# Altium schematic sheet power.SchDoc
size A4
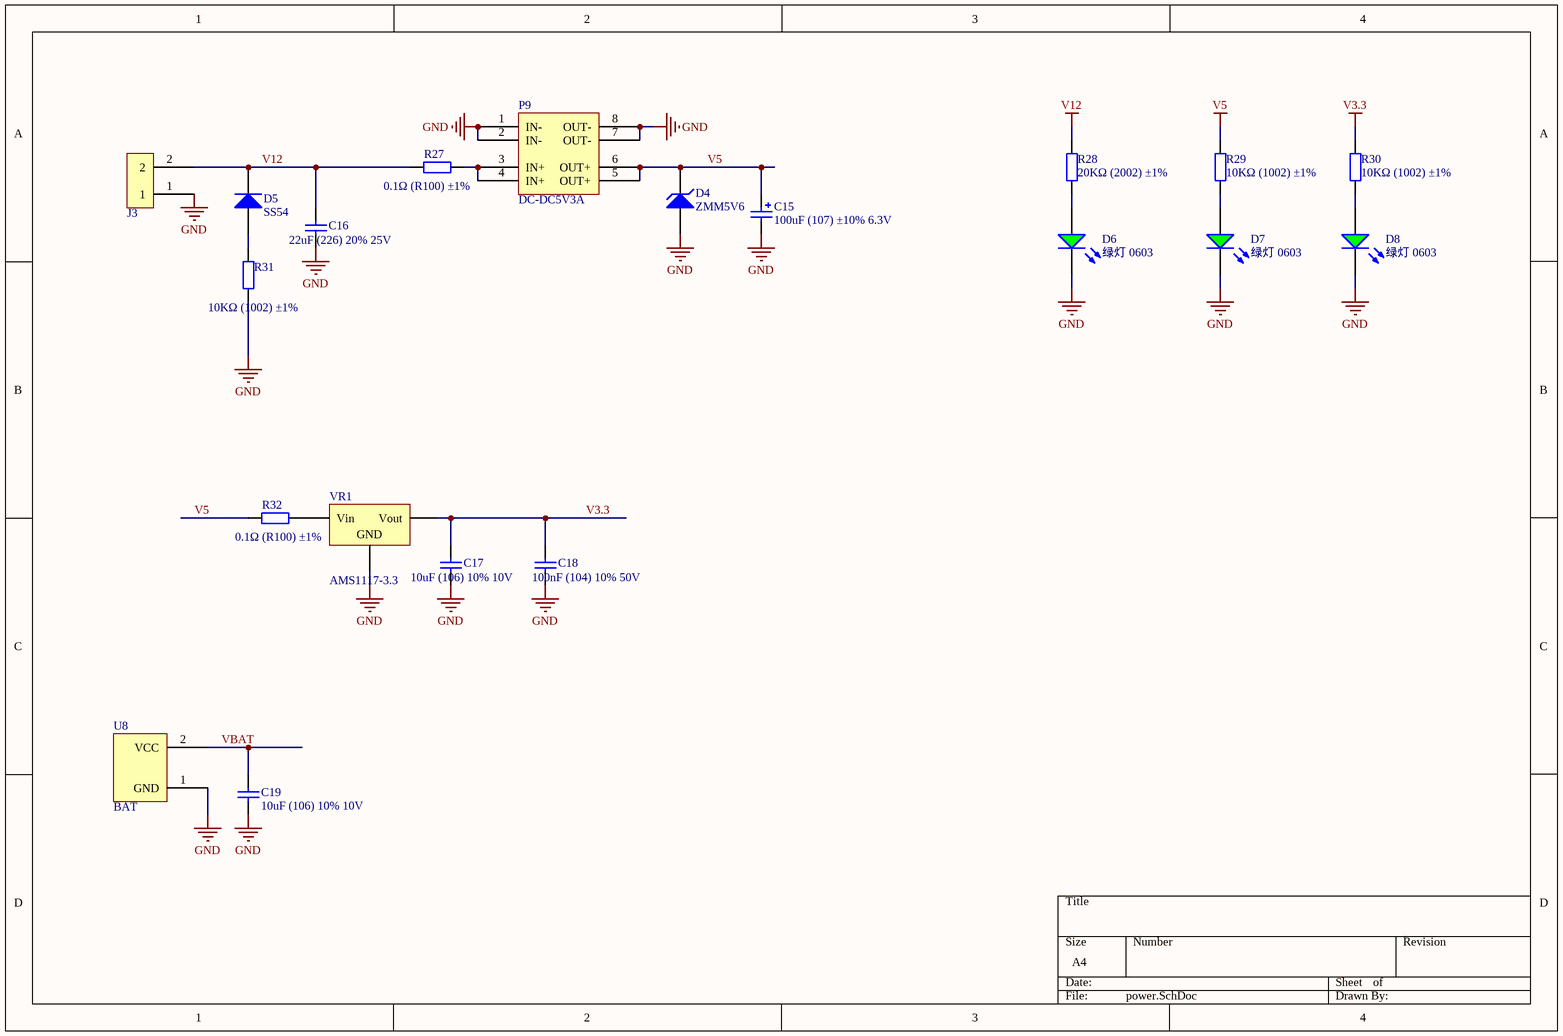
[diagram p0: power.SchDoc]

## Parts
C15  100uF (107) ±10% 6.3V  [CASE-B_3528]
C16  22uF (226) 20% 25V  [0805_C]
C17  10uF (106) 10% 10V  [0603_C]
C18  100nF (104) 10% 50V  [0603_C]
C19  10uF (106) 10% 10V  [0603_C]
D4  ZMM5V6  [LL-34]
D5  SS54  [SMA(DO-214AC)_S1]
D6  绿灯 0603  [0603_LED_S1]
D7  绿灯 0603  [0603_LED_S1]
D8  绿灯 0603  [0603_LED_S1]
J3  XK7.62-2P  [XK7.62-2P]  (value not drawn)
P9  DC-DC5V3A  [DC-DC3A]
R27  0.1Ω (R100) ±1%  [1206_R]
R28  20KΩ (2002) ±1%  [0603_R]
R29  10KΩ (1002) ±1%  [0603_R]
R30  10KΩ (1002) ±1%  [0603_R]
R31  10KΩ (1002) ±1%  [0805_R]
R32  0.1Ω (R100) ±1%  [1206_R]
U8  BAT  [BAT2032]
VR1  AMS1117-3.3  [SOT-223]

## Nets
GND: C15.2 C16.1 C17.1 C18.1 C19.1 D4.1(A) D6.K D7.K D8.K J3.1 P9.1(IN-) P9.2(IN-) P9.7(OUT-) P9.8(OUT-) R31.1 U8.1(GND) VR1.1(GND)
V3.3: C17.2 C18.2 R30.2 VR1.2(Vout)
V5: C15.1 D4.2(K) P9.5(OUT+) P9.6(OUT+) R29.2 R32.1
V12: C16.2 D5.2(K) J3.2 R27.1 R28.2
VBAT: C19.2 U8.2(VCC)
NetD5_1: D5.1(A) R31.2
NetD6_A: D6.A R28.1
NetD7_A: D7.A R29.1
NetD8_A: D8.A R30.1
NetP9_3: P9.3(IN+) P9.4(IN+) R27.2
NetR32_2: R32.2 VR1.3(Vin)

## Library data of the parts
C15 = 3528 100uF (107) 10% 6.3V: 钽电容; ComponentLink1Description: 供应商链接; ComponentLink1URL: http://www.szlcsc.com/product/details_16815.html; Package: 3528; Supplier: LC; SuppliersPartNumber: C16133
C16 = 0805 22uF (226) 20% 25V: 贴片电容; ComponentLink1Description: 供应商链接; ComponentLink1URL: http://www.szlcsc.com/product/details_46786.html; Package: 0805; Supplier: LC; SuppliersPartNumber: C45783
C17 C19 = 0603 10uF (106) 10% 10V: 贴片电容; ComponentLink1Description: 供应商链接; ComponentLink1URL: http://www.szlcsc.com/product/details_20411.html; Package: 0603; Supplier: LC; SuppliersPartNumber: C19702
C18 = 0603 100nF (104) 10% 50V: 贴片电容; ComponentLink1Description: 供应商链接; ComponentLink1URL: http://www.szlcsc.com/product/details_15331.html; Package: 0603; Supplier: LC; SuppliersPartNumber: C14663
D4 = LL-34 ZMM5V6: 稳压二极管; ComponentLink1Description: 供应商链接; ComponentLink1URL: http://www.szlcsc.com/product/details_8541.html; Package: LL-34; Supplier: LC; SuppliersPartNumber: C8062
D5 = SMA(DO-214AC) SS54: 二极管; ComponentLink1Description: 供应商链接; ComponentLink1URL: http://www.szlcsc.com/product/details_23178.html; Package: SMA(DO-214AC); Supplier: LC; SuppliersPartNumber: C22452
D6-D8 = 0603 绿灯: 发光二极管; ComponentLink1Description: 供应商链接; ComponentLink1URL: http://www.szlcsc.com/product/details_73152.html; Package: 0603; Supplier: LC; SuppliersPartNumber: C72043
P9 = DC-DC3A
R27 R32 = 1206 0.1Ω (R100) 1%: 贴片电阻; ComponentLink1Description: 供应商链接; ComponentLink1URL: http://www.szlcsc.com/product/details_26077.html; Package: 1206; Supplier: LC; SuppliersPartNumber: C25334
R28 = 0603 20KΩ (2002) 1%: 贴片电阻; ComponentLink1Description: 供应商链接; ComponentLink1URL: http://www.szlcsc.com/product/details_4591.html; Package: 0603; Supplier: LC; SuppliersPartNumber: C4184
R29 R30 = 0603 10KΩ (1002) 1%: 贴片电阻; ComponentLink1Description: 供应商链接; ComponentLink1URL: http://www.szlcsc.com/product/details_26547.html; Package: 0603; Supplier: LC; SuppliersPartNumber: C25804
R31 = 0805 10KΩ (1002) 1%: 贴片电阻; ComponentLink1Description: 供应商链接; ComponentLink1URL: http://www.szlcsc.com/product/details_18102.html; Package: 0805; Supplier: LC; SuppliersPartNumber: C17414
U8 = BAT2032
VR1 = SOT-223 AMS1117-3.3: 低压差线性稳压(LDO); ComponentLink1Description: 供应商链接; ComponentLink1URL: http://www.szlcsc.com/product/details_6652.html; Package: SOT-223; Supplier: LC; SuppliersPartNumber: C6186